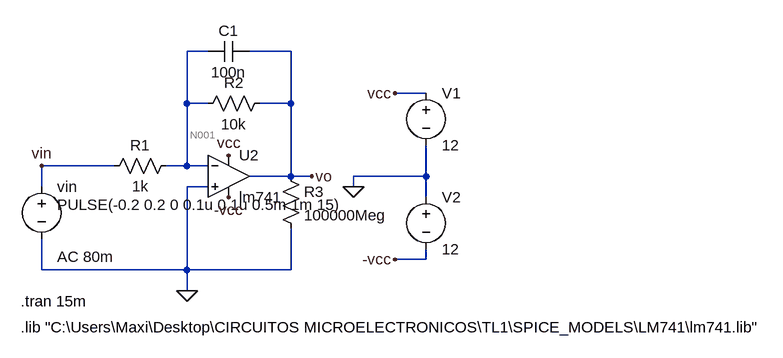
[diagram p0: schematic INTEGRADORconR.asc]
INTEGRADORconR.asc, the LTspice schematic file:
Version 4
SHEET 1 1112 680
WIRE 144 -32 112 -32
WIRE 272 -32 208 -32
WIRE 480 32 432 32
WIRE 112 48 112 -32
WIRE 144 48 112 48
WIRE 272 48 272 -32
WIRE 272 48 224 48
WIRE 0 144 -112 144
WIRE 112 144 112 48
WIRE 112 144 80 144
WIRE 144 144 112 144
WIRE 272 160 272 48
WIRE 272 160 208 160
WIRE 304 160 272 160
WIRE 480 160 480 112
WIRE 480 160 368 160
WIRE -112 176 -112 144
WIRE 144 176 112 176
WIRE 368 176 368 160
WIRE 480 192 480 160
WIRE 480 288 480 272
WIRE 480 288 432 288
WIRE -112 304 -112 256
WIRE 112 304 112 176
WIRE 112 304 -112 304
WIRE 272 304 272 240
WIRE 272 304 112 304
WIRE 112 336 112 304
FLAG 368 176 0
FLAG 432 32 vcc
FLAG 432 288 -vcc
FLAG 176 192 -vcc
FLAG 176 128 vcc
FLAG 112 336 0
FLAG 304 160 vo
FLAG -112 144 vin
SYMBOL res 96 128 R90
WINDOW 0 0 56 VBottom 2
WINDOW 3 32 56 VTop 2
SYMATTR InstName R1
SYMATTR Value 1k
SYMBOL voltage 480 16 R0
SYMATTR InstName V1
SYMATTR Value 12
SYMBOL voltage 480 176 R0
SYMATTR InstName V2
SYMATTR Value 12
SYMBOL voltage -112 160 R0
WINDOW 123 24 124 Left 2
WINDOW 39 0 0 Left 0
WINDOW 3 24 44 Left 2
SYMATTR Value2 AC 80m
SYMATTR Value PULSE(-0.2 0.2 0 0.1u 0.1u 0.5m 1m 15)
SYMATTR InstName vin
SYMBOL res 256 144 R0
SYMATTR InstName R3
SYMATTR Value 100000Meg
SYMBOL cap 208 -48 R90
WINDOW 0 0 32 VBottom 2
WINDOW 3 32 32 VTop 2
SYMATTR InstName C1
SYMATTR Value 100n
SYMBOL res 240 32 R90
WINDOW 0 0 56 VBottom 2
WINDOW 3 32 56 VTop 2
SYMATTR InstName R2
SYMATTR Value 10k
SYMBOL OpAmps\\opamp2 176 96 R0
SYMATTR InstName U2
SYMATTR Value lm741
SYMATTR SpiceModel lm741
TEXT -144 392 Left 2 !.lib "C:\\Users\\Maxi\\Desktop\\CIRCUITOS MICROELECTRONICOS\\TL1\\SPICE_MODELS\\LM741\\lm741.lib"
TEXT -144 352 Left 2 !.tran 15m

The netlist it stands for:
* INTEGRADORconR.asc
R1 N001 vin 1k
V1 vcc 0 12
V2 0 -vcc 12
vin vin 0 PULSE(-0.2 0.2 0 0.1u 0.1u 0.5m 1m 15) AC 80m
R3 vo 0 100000Meg
C1 vo N001 100n
R2 vo N001 10k
XU2 0 N001 vcc -vcc vo lm741 lm741  ; pins In+ In- V+ V- OUT
.lib "C:\Users\Maxi\Desktop\CIRCUITOS MICROELECTRONICOS\TL1\SPICE_MODELS\LM741\lm741.lib"
.tran 15m
.backanno
.end

* Results of the author's LTspice run, read from the files saved beside the schematic
* Operating Point, zero values left out:
*   V(n001) = 989.8 µV
*   V(vin) = -200 mV
*   V(vcc) = 12 V
*   V(-vcc) = -12 V
*   V(vo) = 2.012 V
*   I(R1) = 201 µA
*   I(R3) = 20.12 pA
*   I(R2) = 201.1 µA
*   I(V1) = -1.775 mA
*   I(V2) = -1.574 mA
*   I(Vin) = 201 µA
*   Ix(u2:1) = 57.9 nA
*   Ix(u2:2) = 101.8 nA
*   Ix(u2:99) = 1.775 mA
*   Ix(u2:50) = -1.574 mA
*   Ix(u2:28) = -201.1 µA
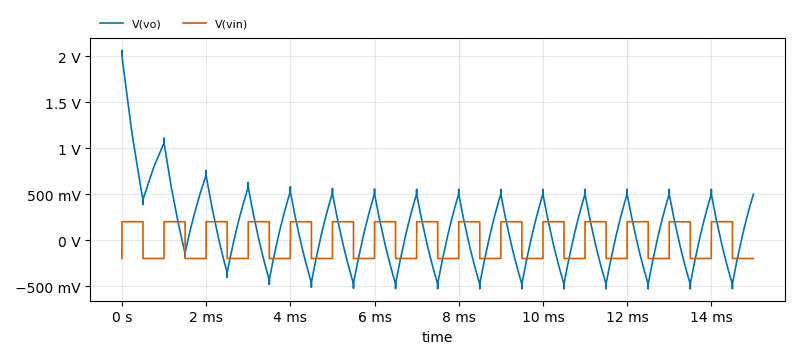
[diagram p1: Transient Analysis of INTEGRADORconR.asc, plotted from the saved traces]
* Transient Analysis, 1 run:
*   V(vo): min -529.6 mV, max 2.064 V, average 112.9 mV, rms 410 mV, last 500.4 mV
*   V(vin): min -200 mV, max 200 mV, average 40 µV, rms 200 mV, last -200 mV